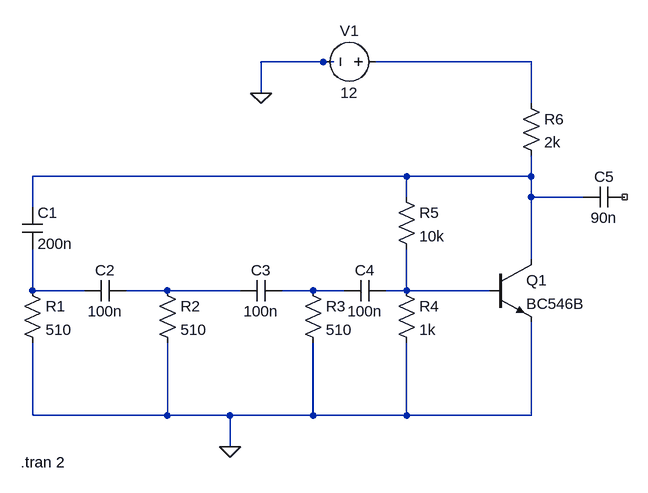
[diagram p0: schematic Draft4.asc]
Draft4.asc, the LTspice schematic file:
Version 4
SHEET 1 880 680
WIRE 336 -144 240 -144
WIRE 352 -144 336 -144
WIRE 656 -144 416 -144
WIRE 240 -96 240 -144
WIRE 656 -80 656 -144
WIRE 464 32 -112 32
WIRE 656 32 656 0
WIRE 656 32 464 32
WIRE 464 64 464 32
WIRE 656 64 656 32
WIRE 736 64 656 64
WIRE -112 80 -112 32
WIRE 656 160 656 64
WIRE -112 208 -112 144
WIRE -32 208 -112 208
WIRE 96 208 32 208
WIRE 208 208 96 208
WIRE 320 208 272 208
WIRE 368 208 320 208
WIRE 464 208 464 144
WIRE 464 208 432 208
WIRE 592 208 464 208
WIRE -112 400 -112 288
WIRE 96 400 96 288
WIRE 96 400 -112 400
WIRE 192 400 96 400
WIRE 320 400 320 288
WIRE 320 400 192 400
WIRE 464 400 464 288
WIRE 464 400 320 400
WIRE 656 400 656 256
WIRE 656 400 464 400
WIRE 192 448 192 400
FLAG 192 448 0
FLAG 240 -96 0
SYMBOL npn 592 160 R0
SYMATTR InstName Q1
SYMATTR Value BC546B
SYMBOL res -128 192 R0
SYMATTR InstName R1
SYMATTR Value 510
SYMBOL res 80 192 R0
SYMATTR InstName R2
SYMATTR Value 510
SYMBOL res 304 192 R0
SYMATTR InstName R3
SYMATTR Value 510
SYMBOL res 448 192 R0
SYMATTR InstName R4
SYMATTR Value 1k
SYMBOL cap -128 80 R0
SYMATTR InstName C1
SYMATTR Value 200n
SYMBOL cap 32 192 R90
WINDOW 0 0 32 VBottom 2
WINDOW 3 32 32 VTop 2
SYMATTR InstName C2
SYMATTR Value 100n
SYMBOL cap 272 192 R90
WINDOW 0 0 32 VBottom 2
WINDOW 3 32 32 VTop 2
SYMATTR InstName C3
SYMATTR Value 100n
SYMBOL cap 432 192 R90
WINDOW 0 0 32 VBottom 2
WINDOW 3 32 32 VTop 2
SYMATTR InstName C4
SYMATTR Value 100n
SYMBOL res 448 48 R0
SYMATTR InstName R5
SYMATTR Value 10k
SYMBOL cap 800 48 R90
WINDOW 0 0 32 VBottom 2
WINDOW 3 32 32 VTop 2
SYMATTR InstName C5
SYMATTR Value 90n
SYMBOL res 640 -96 R0
SYMATTR InstName R6
SYMATTR Value 2k
SYMBOL voltage 432 -144 R90
WINDOW 0 -32 56 VBottom 2
WINDOW 3 32 56 VTop 2
WINDOW 123 0 0 Left 0
WINDOW 39 0 0 Left 0
SYMATTR InstName V1
SYMATTR Value 12
TEXT -130 472 Left 2 !.tran 2

The netlist it stands for:
* Draft4.asc
Q1 N002 N006 0 0 BC546B
R1 N003 0 510
R2 N004 0 510
R3 N005 0 510
R4 N006 0 1k
C1 N002 N003 200n
C2 N004 N003 100n
C3 N005 N004 100n
C4 N006 N005 100n
R5 N002 N006 10k
C5 NC_01 N002 90n
R6 N001 N002 2k
V1 N001 0 12
.model NPN NPN
.model PNP PNP
.lib standard.bjt
.tran 2
.backanno
.end